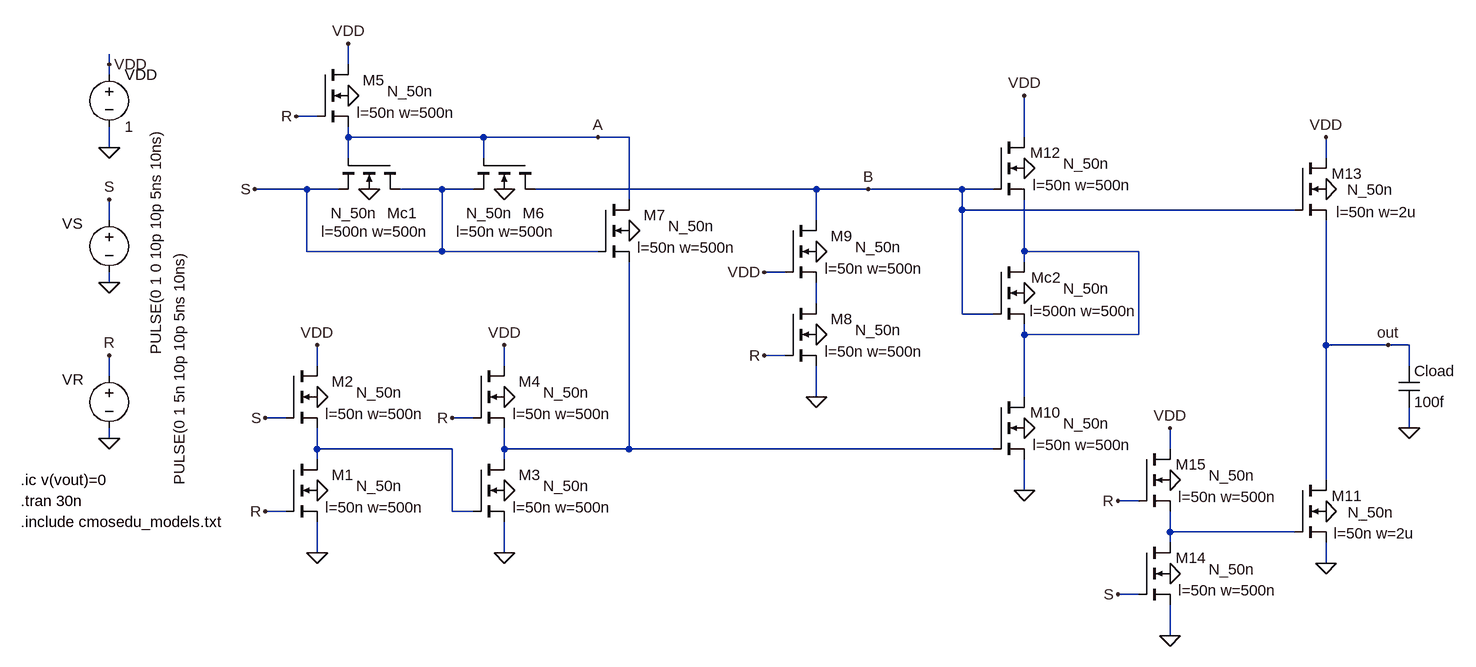
[diagram p0: schematic Fig18_40b.asc]
Fig18_40b.asc, the LTspice schematic file:
Version 4
SHEET 1 2208 680
WIRE 128 -784 128 -800
WIRE 496 -784 496 -816
WIRE 128 -768 128 -784
WIRE 448 -704 416 -704
WIRE 496 -672 496 -688
WIRE 704 -672 496 -672
WIRE 880 -672 704 -672
WIRE 928 -672 880 -672
WIRE 1536 -672 1536 -736
WIRE 128 -656 128 -688
WIRE 496 -640 496 -672
WIRE 704 -640 704 -672
WIRE 2000 -640 2000 -672
WIRE 432 -592 352 -592
WIRE 480 -592 432 -592
WIRE 640 -592 576 -592
WIRE 688 -592 640 -592
WIRE 1216 -592 784 -592
WIRE 1296 -592 1216 -592
WIRE 1440 -592 1296 -592
WIRE 1488 -592 1440 -592
WIRE 928 -576 928 -672
WIRE 1440 -560 1440 -592
WIRE 1952 -560 1440 -560
WIRE 128 -544 128 -576
WIRE 1216 -544 1216 -592
WIRE 432 -496 432 -592
WIRE 640 -496 640 -592
WIRE 640 -496 432 -496
WIRE 880 -496 640 -496
WIRE 1536 -496 1536 -576
WIRE 1712 -496 1536 -496
WIRE 1536 -480 1536 -496
WIRE 1168 -464 1136 -464
WIRE 128 -448 128 -464
WIRE 1216 -416 1216 -448
WIRE 1440 -400 1440 -560
WIRE 1488 -400 1440 -400
WIRE 1536 -368 1536 -384
WIRE 1712 -368 1712 -496
WIRE 1712 -368 1536 -368
WIRE 2000 -352 2000 -544
WIRE 2096 -352 2000 -352
WIRE 2128 -352 2096 -352
WIRE 1168 -336 1136 -336
WIRE 448 -320 448 -352
WIRE 736 -320 736 -352
WIRE 2128 -320 2128 -352
WIRE 128 -304 128 -336
WIRE 1216 -272 1216 -320
WIRE 1536 -272 1536 -368
WIRE 400 -240 368 -240
WIRE 688 -240 656 -240
WIRE 2128 -224 2128 -256
WIRE 128 -208 128 -224
WIRE 448 -192 448 -224
WIRE 656 -192 448 -192
WIRE 736 -192 736 -224
WIRE 928 -192 928 -480
WIRE 928 -192 736 -192
WIRE 1488 -192 928 -192
WIRE 1760 -192 1760 -224
WIRE 448 -176 448 -192
WIRE 736 -176 736 -192
WIRE 2000 -144 2000 -352
WIRE 1536 -128 1536 -176
WIRE 1712 -112 1680 -112
WIRE 400 -96 368 -96
WIRE 656 -96 656 -192
WIRE 688 -96 656 -96
WIRE 1760 -64 1760 -96
WIRE 1952 -64 1760 -64
WIRE 1760 -48 1760 -64
WIRE 448 -32 448 -80
WIRE 736 -32 736 -80
WIRE 2000 -16 2000 -48
WIRE 1712 32 1680 32
WIRE 1760 96 1760 48
FLAG 128 -448 0
FLAG 448 -128 0
FLAG 128 -656 0
FLAG 128 -784 VDD
FLAG 448 -32 0
FLAG 528 -592 0
FLAG 448 -272 0
FLAG 448 -352 VDD
FLAG 128 -576 S
FLAG 128 -208 0
FLAG 128 -336 R
FLAG 368 -96 R
FLAG 368 -240 S
FLAG 736 -128 0
FLAG 736 -32 0
FLAG 736 -272 0
FLAG 736 -352 VDD
FLAG 656 -240 R
FLAG 352 -592 S
FLAG 496 -736 0
FLAG 496 -816 VDD
FLAG 416 -704 R
FLAG 736 -592 0
FLAG 928 -528 0
FLAG 1216 -368 0
FLAG 1216 -272 0
FLAG 1216 -496 0
FLAG 1136 -336 R
FLAG 1136 -464 VDD
FLAG 1536 -224 0
FLAG 1536 -128 0
FLAG 1536 -432 0
FLAG 1536 -624 0
FLAG 2000 -592 0
FLAG 1536 -736 VDD
FLAG 2000 -672 VDD
FLAG 2000 -96 0
FLAG 2128 -224 0
FLAG 2096 -352 out
FLAG 2000 -16 0
FLAG 1760 0 0
FLAG 1760 96 0
FLAG 1760 -144 0
FLAG 1760 -224 VDD
FLAG 1680 -112 R
FLAG 1680 32 S
FLAG 880 -672 A
FLAG 1296 -592 B
SYMBOL nmos4 400 -176 R0
WINDOW 0 104 24 Right 0
WINDOW 3 179 41 Right 0
WINDOW 123 213 74 Right 0
SYMATTR InstName M1
SYMATTR Value N_50n
SYMATTR Value2 l=50n w=500n
SYMBOL voltage 128 -560 R0
WINDOW 0 -72 21 Left 0
WINDOW 3 72 223 VLeft 0
WINDOW 123 0 0 Left 0
WINDOW 39 0 0 Left 0
SYMATTR InstName VS
SYMATTR Value PULSE(0 1 0 10p 10p 5ns 10ns)
SYMBOL voltage 128 -784 R0
WINDOW 123 0 0 Left 0
WINDOW 39 0 0 Left 0
SYMATTR InstName VDD
SYMATTR Value 1
SYMBOL nmos4 576 -640 R90
WINDOW 0 85 20 VLeft 0
WINDOW 3 85 107 VLeft 0
WINDOW 123 113 122 VLeft 0
SYMATTR InstName Mc1
SYMATTR Value N_50n
SYMATTR Value2 l=500n w=500n
SYMBOL nmos4 400 -320 R0
WINDOW 0 104 24 Right 0
WINDOW 3 179 41 Right 0
WINDOW 123 213 74 Right 0
SYMATTR InstName M2
SYMATTR Value N_50n
SYMATTR Value2 l=50n w=500n
SYMBOL voltage 128 -320 R0
WINDOW 0 -72 21 Left 0
WINDOW 3 108 184 VLeft 0
WINDOW 123 0 0 Left 0
WINDOW 39 0 0 Left 0
SYMATTR InstName VR
SYMATTR Value PULSE(0 1 5n 10p 10p 5ns 10ns)
SYMBOL nmos4 688 -176 R0
WINDOW 0 104 24 Right 0
WINDOW 3 179 41 Right 0
WINDOW 123 213 74 Right 0
SYMATTR InstName M3
SYMATTR Value N_50n
SYMATTR Value2 l=50n w=500n
SYMBOL nmos4 688 -320 R0
WINDOW 0 104 24 Right 0
WINDOW 3 179 41 Right 0
WINDOW 123 213 74 Right 0
SYMATTR InstName M4
SYMATTR Value N_50n
SYMATTR Value2 l=50n w=500n
SYMBOL nmos4 448 -784 R0
WINDOW 0 104 24 Right 0
WINDOW 3 179 41 Right 0
WINDOW 123 213 74 Right 0
SYMATTR InstName M5
SYMATTR Value N_50n
SYMATTR Value2 l=50n w=500n
SYMBOL nmos4 784 -640 R90
WINDOW 0 85 20 VLeft 0
WINDOW 3 85 107 VLeft 0
WINDOW 123 113 122 VLeft 0
SYMATTR InstName M6
SYMATTR Value N_50n
SYMATTR Value2 l=50n w=500n
SYMBOL nmos4 880 -576 R0
WINDOW 0 104 24 Right 0
WINDOW 3 179 41 Right 0
WINDOW 123 213 74 Right 0
SYMATTR InstName M7
SYMATTR Value N_50n
SYMATTR Value2 l=50n w=500n
SYMBOL nmos4 1168 -416 R0
WINDOW 0 104 24 Right 0
WINDOW 3 179 41 Right 0
WINDOW 123 213 74 Right 0
SYMATTR InstName M8
SYMATTR Value N_50n
SYMATTR Value2 l=50n w=500n
SYMBOL nmos4 1168 -544 R0
WINDOW 0 104 24 Right 0
WINDOW 3 179 41 Right 0
WINDOW 123 213 74 Right 0
SYMATTR InstName M9
SYMATTR Value N_50n
SYMATTR Value2 l=50n w=500n
SYMBOL nmos4 1488 -272 R0
WINDOW 0 104 24 Right 0
WINDOW 3 179 41 Right 0
WINDOW 123 213 74 Right 0
SYMATTR InstName M10
SYMATTR Value N_50n
SYMATTR Value2 l=50n w=500n
SYMBOL nmos4 1488 -480 R0
WINDOW 0 104 24 Right 0
WINDOW 3 179 41 Right 0
WINDOW 123 222 76 Right 0
SYMATTR InstName Mc2
SYMATTR Value N_50n
SYMATTR Value2 l=500n w=500n
SYMBOL nmos4 1488 -672 R0
WINDOW 0 104 24 Right 0
WINDOW 3 179 41 Right 0
WINDOW 123 213 74 Right 0
SYMATTR InstName M12
SYMATTR Value N_50n
SYMATTR Value2 l=50n w=500n
SYMBOL nmos4 1952 -640 R0
WINDOW 0 104 24 Right 0
WINDOW 3 152 49 Right 0
WINDOW 123 189 83 Right 0
SYMATTR InstName M13
SYMATTR Value N_50n
SYMATTR Value2 l=50n w=2u
SYMBOL nmos4 1952 -144 R0
WINDOW 0 104 24 Right 0
WINDOW 3 153 50 Right 0
WINDOW 123 185 82 Right 0
SYMATTR InstName M11
SYMATTR Value N_50n
SYMATTR Value2 l=50n w=2u
SYMBOL cap 2112 -320 R0
SYMATTR InstName Cload
SYMATTR Value 100f
SYMBOL nmos4 1712 -48 R0
WINDOW 0 104 24 Right 0
WINDOW 3 179 41 Right 0
WINDOW 123 213 74 Right 0
SYMATTR InstName M14
SYMATTR Value N_50n
SYMATTR Value2 l=50n w=500n
SYMBOL nmos4 1712 -192 R0
WINDOW 0 104 24 Right 0
WINDOW 3 179 41 Right 0
WINDOW 123 213 74 Right 0
SYMATTR InstName M15
SYMATTR Value N_50n
SYMATTR Value2 l=50n w=500n
TEXT -8 -112 Left 0 !.tran 30n
TEXT -8 -80 Left 0 !.include cmosedu_models.txt
TEXT -8 -144 Left 0 !.ic v(vout)=0

The netlist it stands for:
* Fig18_40b.asc
M1 N003 R 0 0 N_50n l=50n w=500n
VS S 0 PULSE(0 1 0 10p 10p 5ns 10ns)
VDD VDD 0 1
Mc1 S A S 0 N_50n l=500n w=500n
M2 VDD S N003 0 N_50n l=50n w=500n
VR R 0 PULSE(0 1 5n 10p 10p 5ns 10ns)
M3 N004 N003 0 0 N_50n l=50n w=500n
M4 VDD R N004 0 N_50n l=50n w=500n
M5 VDD R A 0 N_50n l=50n w=500n
M6 B A S 0 N_50n l=50n w=500n
M7 A S N004 0 N_50n l=50n w=500n
M8 N002 R 0 0 N_50n l=50n w=500n
M9 B VDD N002 0 N_50n l=50n w=500n
M10 N001 N004 0 0 N_50n l=50n w=500n
Mc2 N001 B N001 0 N_50n l=500n w=500n
M12 VDD B N001 0 N_50n l=50n w=500n
M13 VDD B out 0 N_50n l=50n w=2u
M11 out N005 0 0 N_50n l=50n w=2u
Cload out 0 100f
M14 N005 S 0 0 N_50n l=50n w=500n
M15 VDD R N005 0 N_50n l=50n w=500n
.model NMOS NMOS
.model PMOS PMOS
.lib standard.mos
.tran 30n
.include cmosedu_models.txt
.ic v(vout)=0
.backanno
.end